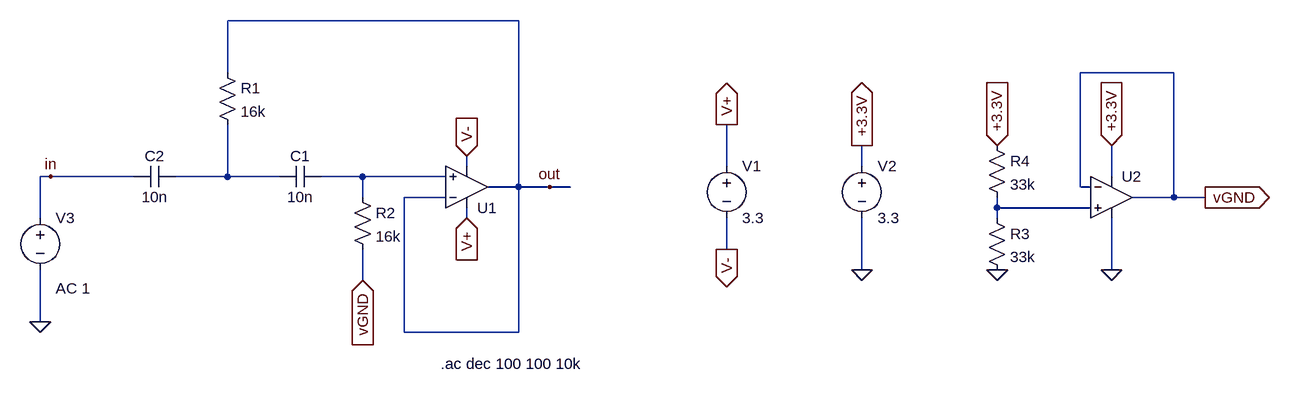
[diagram p0: schematic Perfekter_Hochpass.asc]
Perfekter_Hochpass.asc, the LTspice schematic file:
Version 4
SHEET 1 1436 680
WIRE 256 -112 -192 -112
WIRE -192 -32 -192 -112
WIRE 1264 -32 1120 -32
WIRE 176 112 176 96
WIRE 576 112 576 48
WIRE 784 112 784 80
WIRE -464 128 -480 128
WIRE -336 128 -464 128
WIRE -192 128 -192 48
WIRE -192 128 -272 128
WIRE -112 128 -192 128
WIRE 16 128 -48 128
WIRE 144 128 16 128
WIRE 1168 128 1168 80
WIRE 256 144 256 -112
WIRE 256 144 208 144
WIRE 304 144 256 144
WIRE 336 144 304 144
WIRE 1120 144 1120 -32
WIRE 1136 144 1120 144
WIRE 16 160 16 128
WIRE 144 160 80 160
WIRE 1264 160 1264 -32
WIRE 1264 160 1200 160
WIRE 1312 160 1264 160
WIRE 992 176 992 160
WIRE 1136 176 992 176
WIRE -480 192 -480 128
WIRE 176 192 176 176
WIRE 992 192 992 176
WIRE 576 240 576 192
WIRE 784 272 784 192
WIRE 1168 272 1168 192
WIRE 16 288 16 240
WIRE -480 352 -480 272
WIRE 80 368 80 160
WIRE 256 368 256 144
WIRE 256 368 80 368
FLAG 576 240 V-
IOPIN 576 240 Out
FLAG 576 48 V+
IOPIN 576 48 Out
FLAG 176 192 V+
IOPIN 176 192 In
FLAG 176 96 V-
IOPIN 176 96 In
FLAG 16 288 vGND
IOPIN 16 288 In
FLAG -464 128 in
FLAG 304 144 out
FLAG 784 272 0
FLAG 784 80 +3.3V
IOPIN 784 80 Out
FLAG 992 272 0
FLAG 992 80 +3.3V
IOPIN 992 80 In
FLAG 1312 160 vGND
IOPIN 1312 160 Out
FLAG 1168 80 +3.3V
IOPIN 1168 80 In
FLAG 1168 272 0
FLAG -480 352 0
SYMBOL OpAmps\\UniversalOpamp2 176 144 M180
SYMATTR InstName U1
SYMATTR Value2 Avol=400k GBW=1Meg Slew=600k
SYMATTR SpiceLine Ilimit=20m Rail=25m Vos=0 phimargin=90
SYMATTR SpiceLine2 En=0 Enk=0 In=0 Ink=0 Rin=10T
SYMBOL voltage 576 96 R0
SYMATTR InstName V1
SYMATTR Value 3.3
SYMBOL cap -112 144 R270
WINDOW 0 32 32 VTop 2
WINDOW 3 0 32 VBottom 2
SYMATTR InstName C1
SYMATTR Value 10n
SYMBOL cap -336 144 R270
WINDOW 0 32 32 VTop 2
WINDOW 3 0 32 VBottom 2
SYMATTR InstName C2
SYMATTR Value 10n
SYMBOL res -208 -48 R0
SYMATTR InstName R1
SYMATTR Value 16k
SYMBOL res 0 144 R0
SYMATTR InstName R2
SYMATTR Value 16k
SYMBOL voltage -480 176 R0
WINDOW 123 24 124 Left 2
WINDOW 39 0 0 Left 0
SYMATTR Value2 AC 1
SYMATTR InstName V3
SYMATTR Value ""
SYMBOL voltage 784 96 R0
SYMATTR InstName V2
SYMATTR Value 3.3
SYMBOL OpAmps\\UniversalOpamp2 1168 160 R0
SYMATTR InstName U2
SYMBOL res 976 176 R0
SYMATTR InstName R3
SYMATTR Value 33k
SYMBOL res 976 64 R0
SYMATTR InstName R4
SYMATTR Value 33k
TEXT 136 416 Left 2 !.ac dec 100 100 10k

The netlist it stands for:
* Perfekter_Hochpass.asc
XU1 N002 out V+ V- out level.2 Avol=400k GBW=1Meg Slew=600k Ilimit=20m Rail=25m Vos=0 phimargin=90 En=0 Enk=0 In=0 Ink=0 Rin=10T  ; pins IN+ IN- V+ V- OUT
V1 V+ V- 3.3
C1 N001 N002 10n
C2 in N001 10n
R1 out N001 16k
R2 N002 vGND 16k
V3 in 0 AC 1
V2 +3.3V 0 3.3
XU2 N003 vGND +3.3V 0 vGND level.2 Avol=1Meg GBW=10Meg Slew=10Meg ilimit=25m rail=0 Vos=0 phimargin=45 en=0 enk=0 in=0 ink=0 Rin=500Meg  ; pins IN+ IN- V+ V- OUT
R3 N003 0 33k
R4 +3.3V N003 33k
.ac dec 100 100 10k
.lib UniversalOpamps2.sub
.backanno
.end